# EAGLE design dcc-monitor (EAGLE 9.2.0)
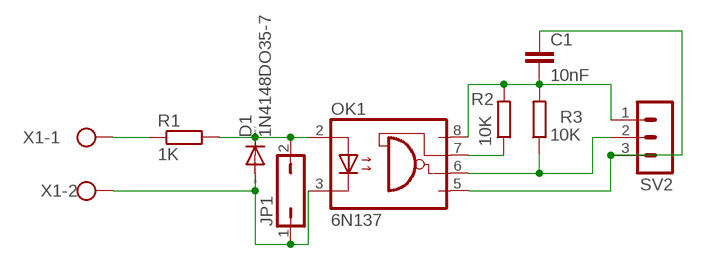
[diagram p0: schematic, sheet 1]

## Parts
C1  10nF  C-EU025-025X050  [C025-025X050]
D1  1N4148DO35-7  [DO35-7]
JP1  JP1Q  [JP1]
OK1  6N137  [DIL08]
R1  1K  R-EU_0309/12  [0309/12]
R2  10K  R-EU_0309/12  [0309/12]
R3  10K  R-EU_0309/12  [0309/12]
SV2  MA03-1  [MA03-1]
X1  W237-102  [W237-102]

## Nets
N$1: C1.1 OK1.5(GND) SV2.3
N$3: OK1.7(VE) R2.1
N$4: OK1.6(VO) R3.1 SV2.2
N$5: D1.A JP1.1 OK1.3(C) X1.2
N$6: D1.C JP1.2 OK1.2(A) R1.2
N$7: R1.1 X1.1
N$8: C1.2 OK1.8(VCC) R2.2 R3.2 SV2.1

## Library data of the parts
C1 = rcl:C-EU: CAPACITOR, European symbol; SPICEPREFIX: C
D1 = diode:1N4148: DIODE high speed (Philips)
JP1 = jumper:JP1Q: JUMPER
OK1 = optocoupler:6N137: MOTOROLA OPTO COUPLER; MPN: 6N137; OC_FARNELL: 1328376; OC_NEWARK: 52M1895
R1-R3 = rcl:R-EU_: RESISTOR, European symbol; SPICEPREFIX: R
SV2 = con-lstb:MA03-1: PIN HEADER; OC_FARNELL: unknown; OC_NEWARK: unknown
X1 = con-wago-500:W237-102: WAGO SCREW CLAMP; MPN: 237-102; OC_FARNELL: unknown; OC_NEWARK: 70K9898

## Board
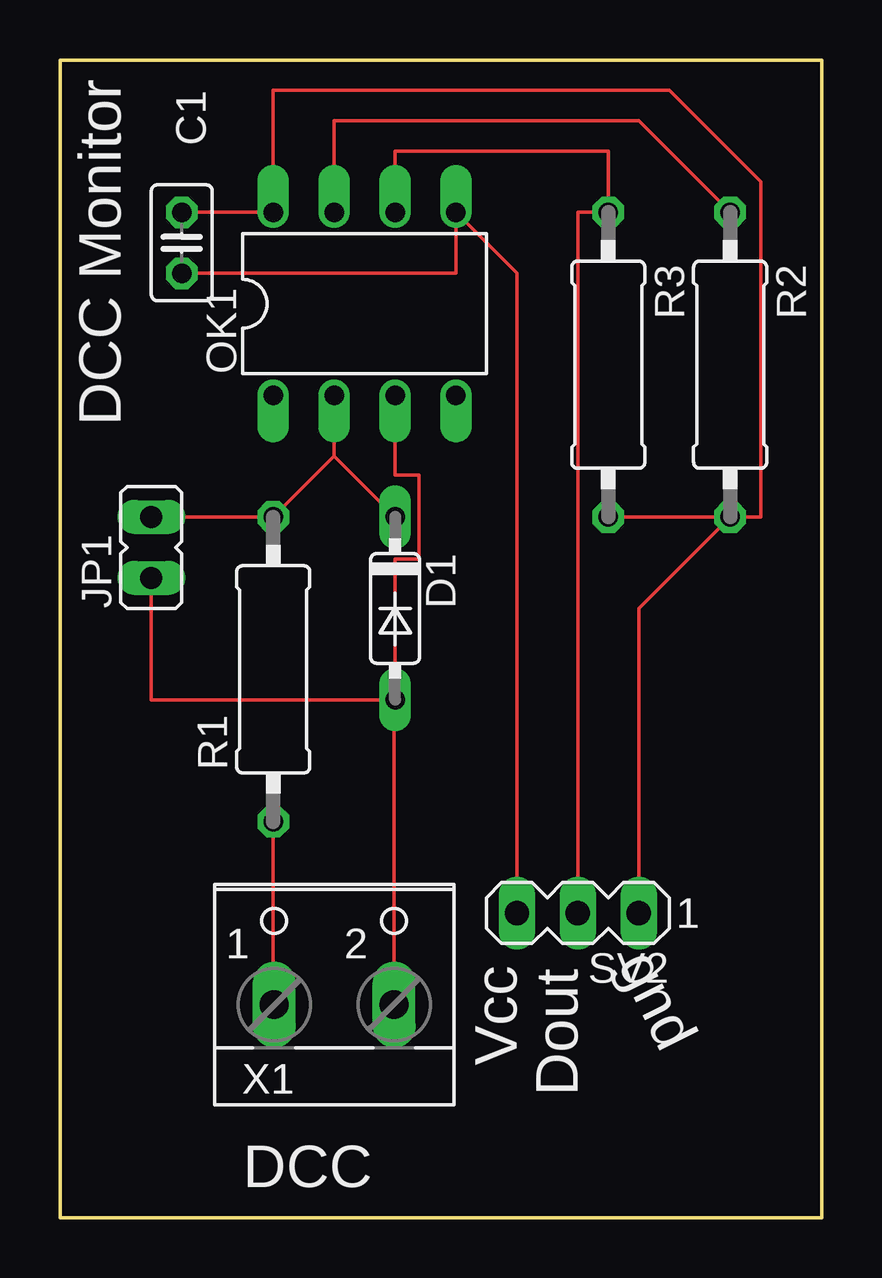
[diagram p1: board, top side]

Size 31.75 x 48.26 mm. Coordinates in mm from the lower left corner, seen from the top.
Outline: 0,0 0,48.26 31.75,48.26 31.75,0 0,0
Copper layers (1*16): Top 0.035mm / dielectric 1.5mm / Bottom 0.035mm
Design rules "default": minimum track width 6mil, minimum drill 0.35mm, track to track 6mil, track to pad 6mil, pad to pad 6mil, via to via 6mil, smd to smd 6mil, copper to edge 40mil, drill to drill 6mil, minimum pad ring 10mil, minimum via ring 8mil, stop-mask expansion 4mil, vias tented up to drill 0mil, thermal gap 10mil

### Footprints (pad centres in the part's own frame; a part is rotated, then mirrored left to right if it is on the bottom)
C025-025X050 = drill 0.813 octagon: 1 -1.27,0; 2 1.27,0
DO35-7 = drill 0.813 long: A 3.81,0; C -3.81,0
JP1 = drill 0.914 long: 1 0,-1.27; 2 0,1.27
DIL08 = drill 0.813 offset: 1 -3.81,-3.81; 2 -1.27,-3.81; 3 1.27,-3.81; 4 3.81,-3.81; 5 3.81,3.81; 6 1.27,3.81; 7 -1.27,3.81; 8 -3.81,3.81
0309/12 = drill 0.813 octagon: 1 -6.35,0; 2 6.35,0
MA03-1 = drill 1.016 long: 1 -2.54,0; 2 0,0; 3 2.54,0
W237-102 = drill 1.194 long: 1 -2.5,-1.27; 2 2.5,-1.27

### Placement (x,y rotation side)
C1  5.08,40.64 90 top
D1  13.97,25.4 270 top
JP1  3.81,27.94 0 top
OK1  12.7,38.1 0 top
R1  8.89,22.86 90 top
R2  27.94,35.56 270 top
R3  22.86,35.56 270 top
SV2  21.59,12.7 180 top
X1  11.43,10.16 0 top

### Tracks (layer width: path | path; a pad name or v marks a point on that pad's centre or on a via)
N$1
  Top 0.152: SV2.3 19.05,39.37 OK1.5 16.51,39.37 C1.1
N$3
  Top 0.152: R2.1 24.13,45.72 11.43,45.72 OK1.7
N$4
  Top 0.152: OK1.6 13.97,44.45 22.86,44.45 R3.1 21.59,41.91 SV2.2
N$5
  Top 0.152: X1.2 13.93,21.55 D1.A | JP1.1 3.81,21.59 D1.A | D1.A 13.97,27.46 14.96,27.46 14.96,30.96 13.97,30.96 OK1.3
N$6
  Top 0.152: 11.43,31.75 R1.2 JP1.2 | D1.C 11.43,31.75 | 11.43,31.75 OK1.2
N$7
  Top 0.152: X1.1 8.89,8.93 R1.1
N$8
  Top 0.152: R3.2 R2.2 | SV2.1 24.13,25.4 R2.2 | R2.2 29.21,29.21 29.21,43.18 25.4,46.99 8.89,46.99 OK1.8 C1.2

### Text on the board
tNames: DCC Monitor | gnd | Vcc | Dout | DCC